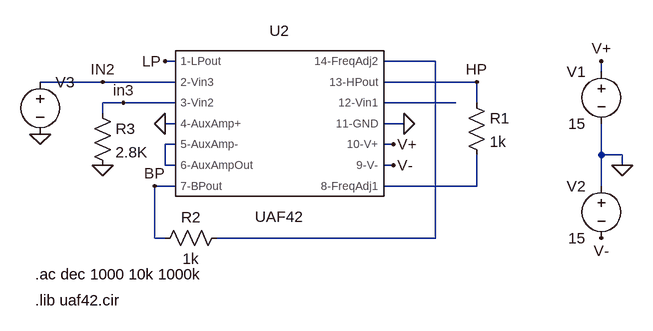
[diagram p0: schematic UAF42 BP Demo.asc]
UAF42 BP Demo.asc, the LTspice schematic file:
Version 4
SHEET 1 880 752
WIRE 128 80 112 80
WIRE 528 80 448 80
WIRE 784 96 784 80
WIRE 16 112 -80 112
WIRE 128 112 16 112
WIRE 592 112 448 112
WIRE 48 144 16 144
WIRE 128 144 48 144
WIRE 560 144 448 144
WIRE 592 144 592 112
WIRE 16 160 16 144
WIRE 128 176 112 176
WIRE 480 176 448 176
WIRE 128 208 112 208
WIRE 464 208 448 208
WIRE 784 224 784 176
WIRE 816 224 784 224
WIRE 112 240 112 208
WIRE 128 240 112 240
WIRE 464 240 448 240
WIRE 816 240 816 224
WIRE 128 272 96 272
WIRE 592 272 592 224
WIRE 592 272 448 272
WIRE 784 272 784 224
WIRE 96 352 96 272
WIRE 112 352 96 352
WIRE 528 352 528 80
WIRE 528 352 192 352
FLAG 816 240 0
FLAG 16 240 0
FLAG -80 192 0
FLAG 96 272 BP
FLAG 16 112 IN2
FLAG 112 80 LP
FLAG 592 112 HP
FLAG 48 144 in3
FLAG 112 176 0
FLAG 480 176 0
FLAG 784 80 V+
FLAG 784 352 V-
FLAG 464 208 V+
FLAG 464 240 V-
SYMBOL voltage 784 80 M0
WINDOW 123 0 0 Left 2
WINDOW 39 0 0 Left 2
SYMATTR InstName V1
SYMATTR Value 15
SYMBOL voltage 784 256 M0
WINDOW 123 0 0 Left 2
WINDOW 39 0 0 Left 2
SYMATTR InstName V2
SYMATTR Value 15
SYMBOL res 576 128 R0
SYMATTR InstName R1
SYMATTR Value 1k
SYMBOL res 208 336 R90
WINDOW 0 0 56 VBottom 2
WINDOW 3 32 56 VTop 2
SYMATTR InstName R2
SYMATTR Value 1k
SYMBOL res 0 144 R0
SYMATTR InstName R3
SYMATTR Value 2.8K
SYMBOL voltage -80 96 R0
WINDOW 3 -227 169 Left 2
WINDOW 39 0 0 Left 2
SYMATTR Value ""
SYMATTR Value2 AC 1 0
SYMATTR InstName V3
SYMBOL UAF42 288 176 R0
SYMATTR InstName U2
TEXT -88 408 Left 2 !.ac dec 1000 10k 1000k
TEXT -88 448 Left 2 !.lib uaf42.cir

The netlist it stands for:
* UAF42 BP Demo.asc
V1 V+ 0 15
V2 0 V- 15
R1 HP N004 1k
R2 N001 BP 1k
R3 in3 0 2.8K
V3 IN2 0 AC 1 0
XU2 LP IN2 in3 0 N003 N003 BP N004 V- V+ 0 N002 HP N001 UAF42  ; pins 1-LPout 2-Vin3 3-Vin2 4-AuxAmp+ 5-AuxAmp- 6-AuxAmpOut 7-BPout 8-FreqAdj1 9-V- 10-V+ 11-GND 12-Vin1 13-HPout 14-FreqAdj2
.ac dec 1000 10k 1000k
.lib uaf42.cir
.lib uaf42.cir
.backanno
.end